# EAGLE design serial (EAGLE 7.3.0)
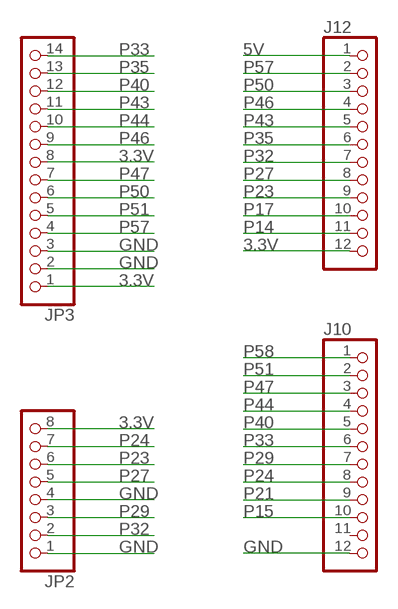
[diagram p0: schematic, sheet 1]

## Parts
J10  PINHD-1X12  [1X12]
J12  PINHD-1X12  [1X12]
JP2  PINHD-1X8  [1X08]
JP3  PINHD-1X14  [1X14]

## Nets
3.3V: J12.12 JP2.8 JP3.1 JP3.8
5V: J12.1
GND: J10.12 JP2.1 JP2.4 JP3.2 JP3.3
P14: J12.11
P15: J10.10
P17: J12.10
P21: J10.9
P23: J12.9 JP2.6
P24: J10.8 JP2.7
P27: J12.8 JP2.5
P29: J10.7 JP2.3
P32: J12.7 JP2.2
P33: J10.6 JP3.14
P35: J12.6 JP3.13
P40: J10.5 JP3.12
P43: J12.5 JP3.11
P44: J10.4 JP3.10
P46: J12.4 JP3.9
P47: J10.3 JP3.7
P50: J12.3 JP3.6
P51: J10.2 JP3.5
P57: J12.2 JP3.4
P58: J10.1
Unconnected: J10.11

## Library data of the parts
J10 J12 = pinhead:PINHD-1X12: PIN HEADER
JP2 = pinhead:PINHD-1X8: PIN HEADER
JP3 = pinhead:PINHD-1X14: PIN HEADER

## Board
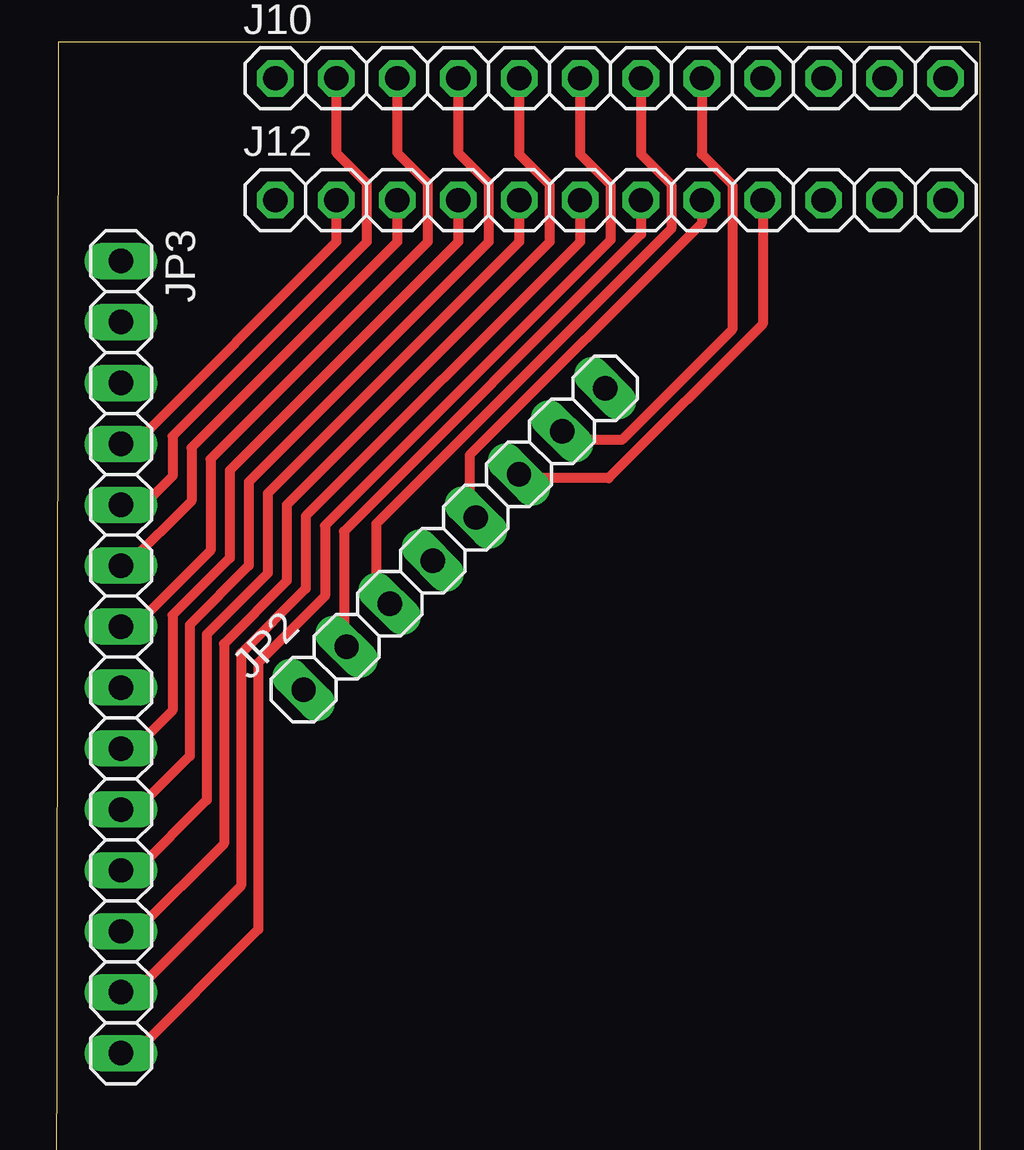
[diagram p1: board, top side]
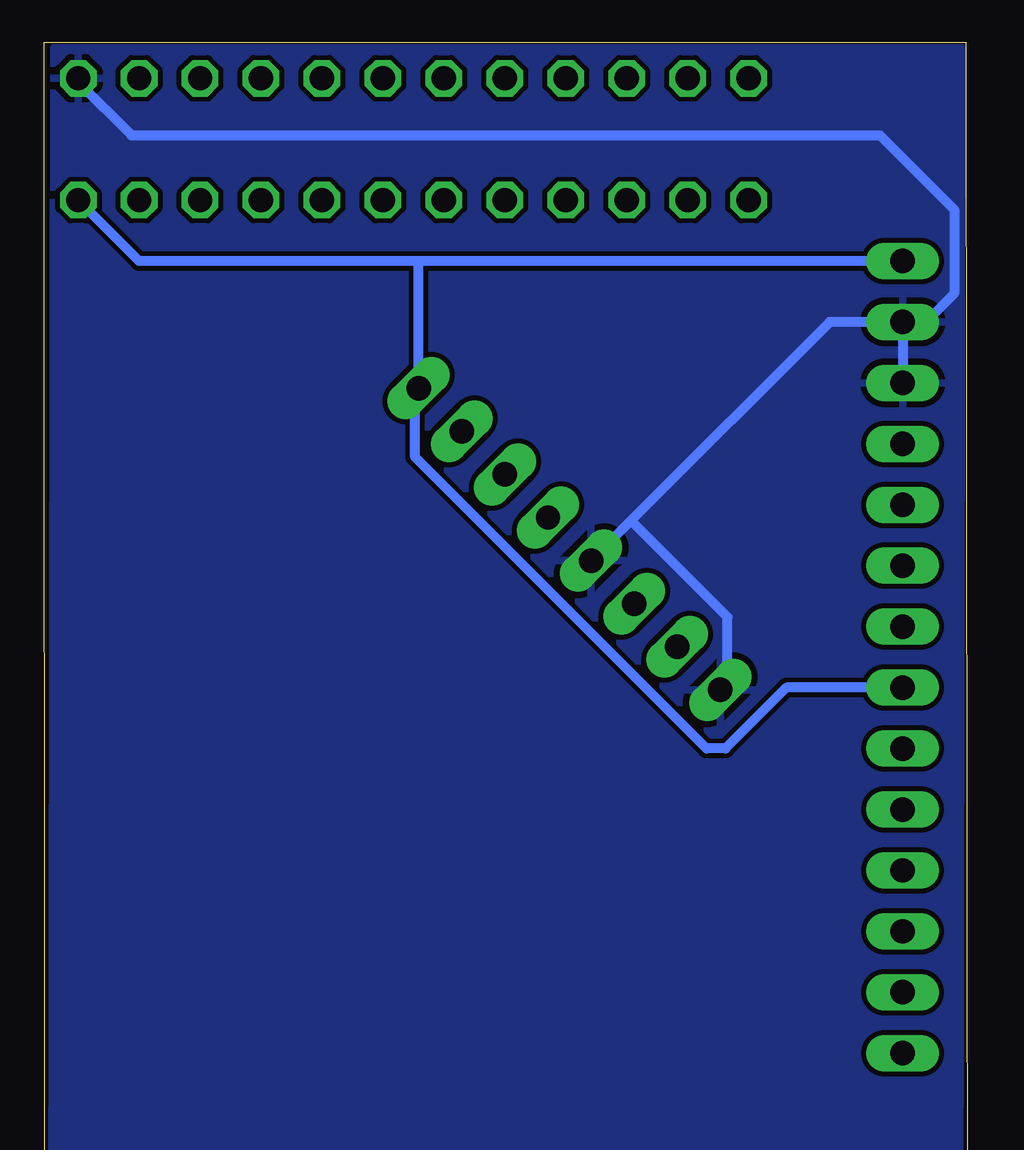
[diagram p2: board, bottom side, seen from below]

No outline drawn. Coordinates in mm, seen from the top.
Copper layers (1*16): Top 0.035mm / dielectric 1.5mm / Bottom 0.035mm
Design rules "default": minimum track width 10mil, minimum drill 24mil, track to track 8mil, track to pad 8mil, pad to pad 8mil, via to via 8mil, smd to smd 8mil, copper to edge 40mil, drill to drill 8mil, minimum pad ring 10mil, minimum via ring 8mil, stop-mask expansion 4mil, vias tented up to drill 0mil, thermal gap 10mil
Milling: 4 lines

### Footprints (pad centres in the part's own frame; a part is rotated, then mirrored left to right if it is on the bottom)
1X12 = drill 1.016 octagon: 1 -13.97,0; 2 -11.43,0; 3 -8.89,0; 4 -6.35,0; 5 -3.81,0; 6 -1.27,0; 7 1.27,0; 8 3.81,0; 9 6.35,0; 10 8.89,0; 11 11.43,0; 12 13.97,0
1X08 = drill 1.016 long: 1 -8.89,0; 2 -6.35,0; 3 -3.81,0; 4 -1.27,0; 5 1.27,0; 6 3.81,0; 7 6.35,0; 8 8.89,0
1X14 = drill 1.016 long: 1 -16.51,0; 2 -13.97,0; 3 -11.43,0; 4 -8.89,0; 5 -6.35,0; 6 -3.81,0; 7 -1.27,0; 8 1.27,0; 9 3.81,0; 10 6.35,0; 11 8.89,0; 12 11.43,0; 13 13.97,0; 14 16.51,0

### Placement (x,y rotation side)
J10  23.1,49.53 0 top
J12  23.1,44.45 0 top
JP2  16.59,30.32 45 top
JP3  2.7,25.4 270 top

### Tracks (layer width: path | path; a pad name or v marks a point on that pad's centre or on a via)
3.3V
  Bottom 0.406: JP3.1 22.86,41.91 | 22.86,41.91 34.53,41.91 J12.12 | 22.86,41.91 22.88,41.89 JP2.8 23.02,36.46 23.02,33.73 10.87,21.59 10.08,21.59 7.54,24.13 JP3.8
GND
  Bottom 0.406: JP3.2 5.75,39.37 14.02,31.09 | 14.02,31.09 JP2.4 | JP2.1 10.26,24.04 10,24.29 10,27.07 14.02,31.09 | J10.12 37.07,49.37 34.85,47.15 3.65,47.15 0.56,44.05 0.56,40.56 1.75,39.37 JP3.2 | JP3.2 JP3.3
  pour Bottom: 0.24,50.8 38.1,50.8 38.18,0.32 0.32,0.32
P23
  Top 0.406: J12.9 29.45,39.29 23.02,32.86 19.44,32.86 JP2.6
P24
  Top 0.406: J10.8 26.91,46.35 28.18,45.09 28.18,39.05 23.57,34.45 21.44,34.45 JP2.7
P27
  Top 0.406: J12.8 26.91,43.5 17.22,33.81 17.22,31.48 JP2.5
P29
  Top 0.406: J10.7 24.37,46.35 25.64,45.09 25.64,43.26 13.34,30.96 13.34,28.19 JP2.3
P32
  Top 0.406: J12.7 24.37,43.02 11.99,30.64 11.99,25.95 JP2.2
P33
  Top 0.406: J10.6 21.83,46.35 23.1,45.09 23.1,42.78 11.19,30.88 11.19,27.94 8.41,25.16 8.41,14.05 3.25,8.89 JP3.14
P35
  Top 0.406: J12.6 21.83,42.7 10.4,31.27 10.4,28.26 7.7,25.56 7.7,15.88 3.25,11.43 JP3.13
P40
  Top 0.406: J10.5 19.29,46.35 20.56,45.09 20.56,42.7 9.6,31.75 9.6,28.57 6.99,25.96 6.99,17.62 3.33,13.97 JP3.12
P43
  Top 0.406: J12.5 19.29,42.7 8.81,32.23 8.81,28.89 6.27,26.35 6.27,19.45 3.25,16.43 2.78,16.43 JP3.11
P44
  Top 0.406: J10.4 16.75,46.43 18.02,45.16 18.02,42.7 8.02,32.7 8.02,29.21 5.56,26.75 5.56,21.27 3.33,19.05 JP3.10
P46
  Top 0.406: J12.4 16.75,42.7 7.22,33.18 7.22,29.53 4.84,27.15 4.84,23.18 3.25,21.59 JP3.9
P47
  Top 0.406: J10.3 14.21,46.43 15.48,45.16 15.48,42.7 6.43,33.66 6.43,29.84 3.25,26.67 JP3.7
P50
  Top 0.406: J12.3 14.21,42.7 5.64,34.13 5.64,31.91 2.94,29.21 JP3.6
P51
  Top 0.406: J10.2 11.67,46.43 12.94,45.16 12.94,42.7 4.84,34.61 4.84,32.94 3.73,31.83 2.78,31.83 JP3.5
P57
  Top 0.406: J12.2 11.67,42.7 3.25,34.29 JP3.4